# Altium schematic sheet 2.电源.SchDoc
size 297 x 209 mm; SheetNumber: 2; SheetTotal: 13
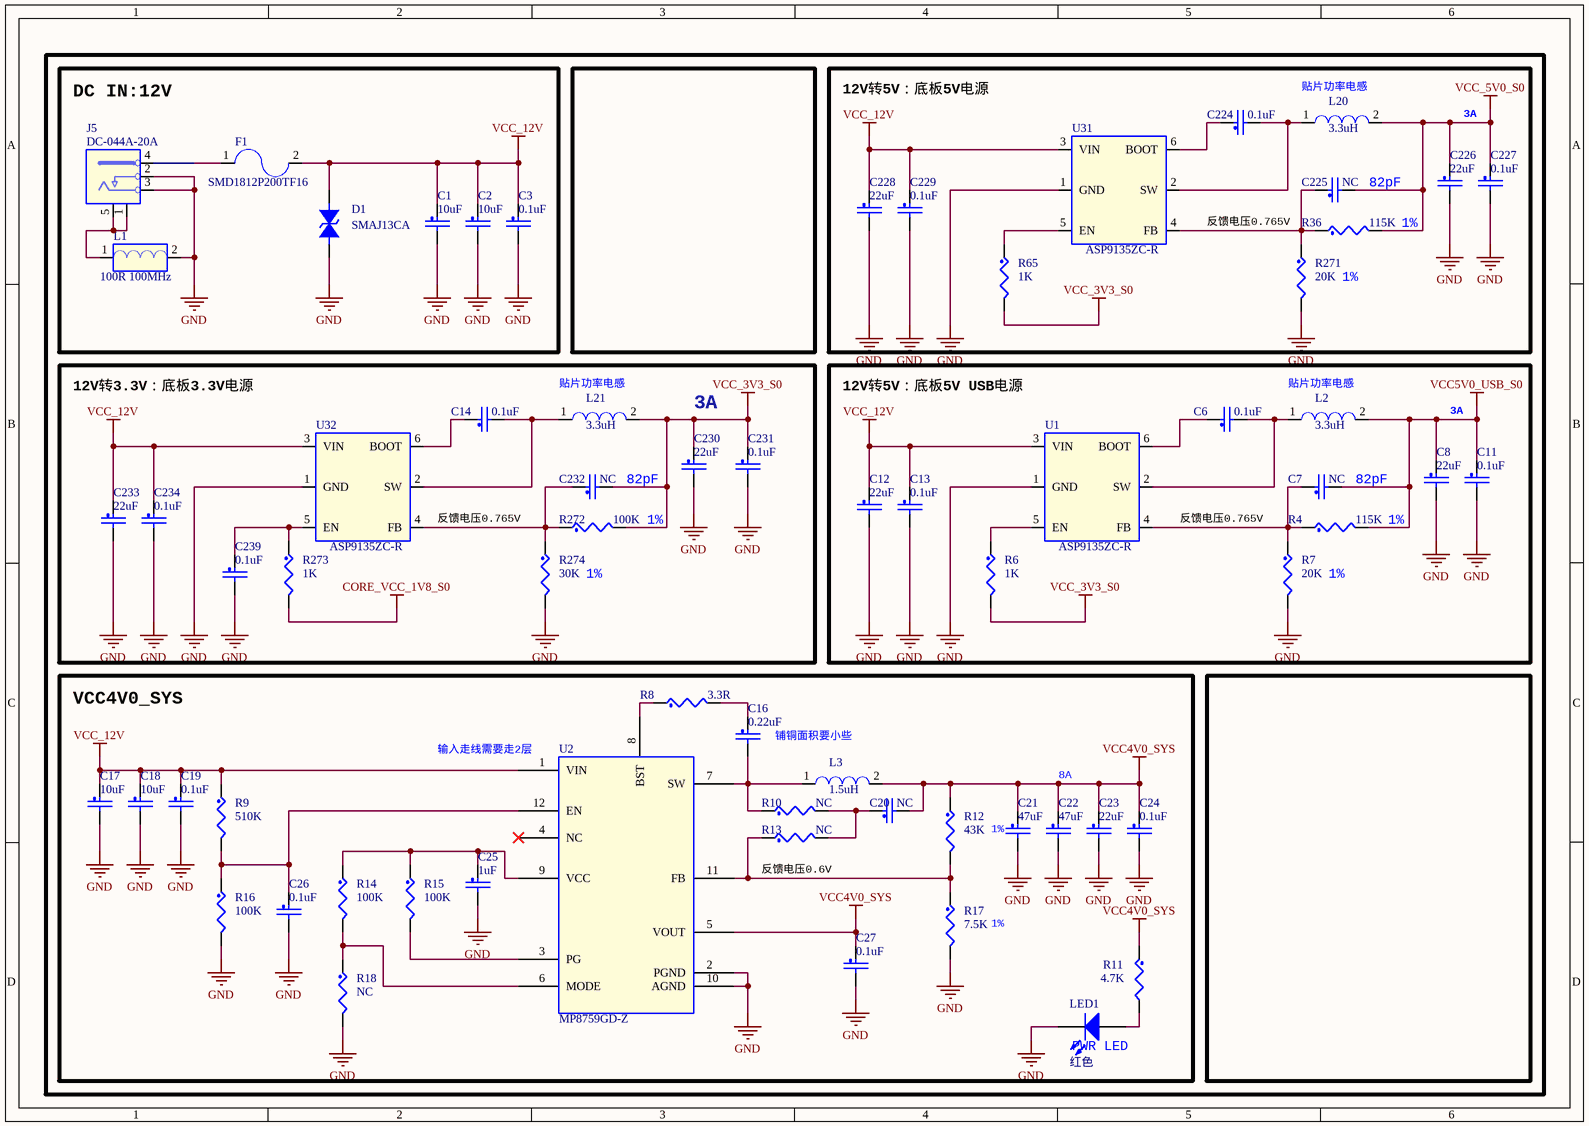
[diagram p0: 2.电源.SchDoc]

## Parts
C1  10uF  [C0603]
C2  10uF  [C0603]
C3  0.1uF  [C0402]
C6  0.1uF  [C0402]
C7  NC  [C0402]
C8  22uF  [C0805]
C11  0.1uF  [C0402]
C12  22uF  [C0805]
C13  0.1uF  [C0402]
C14  0.1uF  [C0402]
C16  0.22uF  [C0402]
C17  10uF  [C0603]
C18  10uF  [C0603]
C19  0.1uF  [C0402]
C20  NC  [C0402]
C21  47uF  [C0805]
C22  47uF  [C0805]
C23  22uF  [C0603]
C24  0.1uF  [C0402]
C25  1uF  [C0402]
C26  0.1uF  [C0402]
C27  0.1uF  [C0402]
C224  0.1uF  [C0402]
C225  NC  [C0402]
C226  22uF  [C0805]
C227  0.1uF  [C0402]
C228  22uF  [C0805]
C229  0.1uF  [C0402]
C230  22uF  [C0805]
C231  0.1uF  [C0402]
C232  NC  [C0402]
C233  22uF  [C0805]
C234  0.1uF  [C0402]
C239  0.1uF  [C0402]
D1  SMAJ13CA  [SMA_CA]
F1  SMD1812P200TF16  [F1812]
J5  DC-044A-20A  [dc_in_th_3p_10r1x11r6]
L1  100R 100MHz  [L0603]
L2  3.3uH  [l4520]
L3  1.5uH  [L0518]
L20  3.3uH  [l4520]
L21  3.3uH  [l4520]
LED1  红色  [LED0603_R]
R4  115K  [R0402]
R6  1K  [R0402]
R7  20K  [R0402]
R8  3.3R  [R0402]
R9  510K  [R0402]
R10  NC  [R0402]
R11  4.7K  [R0402]
R12  43K  [R0402]
R13  NC  [R0402]
R14  100K  [R0402]
R15  100K  [R0402]
R16  100K  [R0402]
R17  7.5K  [R0402]
R18  NC  [R0402]
R36  115K  [R0402]
R65  1K  [R0402]
R271  20K  [R0402]
R272  100K  [R0402]
R273  1K  [R0402]
R274  30K  [R0402]
U1  ASP9135ZC-R  [SOT23_6]
U2  MP8759GD-Z  [QFN12-2R00X3R00]
U31  ASP9135ZC-R  [SOT23_6]
U32  ASP9135ZC-R  [SOT23_6]

## Blocks framed on the sheet
DC IN:12V: C1-C3 D1 F1 J5 L1
12V转5V：底板5V电源: C224-C229 L20 R36 R65 R271 U31
3A: C14 C230-C234 C239 L21 R272-R274 U32
12V转5V：底板5V USB电源: C6-C8 C11-C13 L2 R4 R6 R7 U1
VCC4V0_SYS: C16-C27 L3 LED1 R8-R18 U2

## Nets
CORE_VCC_1V8_S0: R273.2
GND: C1.2 C2.2 C3.2 C8.2 C11.2 C12.2 C13.2 C17.2 C18.2 C19.2 C21.2 C22.2 C23.2 C24.2 C25.2 C26.2 C27.2 C226.2 C227.2 C228.2 C229.2 C230.2 C231.2 C233.2 C234.2 C239.2 D1.1 J5.2 J5.3 L1.2 LED1.2(K) R7.2 R16.2 R17.2 R18.2 R271.2 R274.2 U1.1(GND) U2.2(PGND) U2.10(AGND) U31.1(GND) U32.1(GND)
VCC4V0_SYS: C20.2 C21.1 C22.1 C23.1 C24.1 C27.1 L3.2 R11.1 R12.1 U2.5(VOUT)
VCC5V0_USB_S0: C7.2 C8.1 C11.1 L2.2 R4.2
VCC_3V3_S0: C230.1 C231.1 C232.2 L21.2 R6.2 R65.2 R272.2
VCC_5V0_S0: C225.2 C226.1 C227.1 L20.2 R36.2
VCC_12V: C1.1 C2.1 C3.1 C12.1 C13.1 C17.1 C18.1 C19.1 C228.1 C229.1 C233.1 C234.1 D1.2 F1.2 R9.1 U1.3(VIN) U2.1(VIN) U31.3(VIN) U32.3(VIN)
NetC6_1: C6.1 U1.6(BOOT)
NetC6_2: C6.2 L2.1 U1.2(SW)
NetC7_1: C7.1 R4.1 R7.1 U1.4(FB)
NetC14_1: C14.1 U32.6(BOOT)
NetC14_2: C14.2 L21.1 U32.2(SW)
NetC16_1: C16.1 R8.2
NetC16_2: C16.2 L3.1 R10.1 U2.7(SW)
NetC20_1: C20.1 R10.2 R13.2
NetC25_1: C25.1 R14.1 R15.1 U2.9(VCC)
NetC26_1: C26.1 R9.2 R16.1 U2.12(EN)
NetC224_1: C224.1 U31.6(BOOT)
NetC224_2: C224.2 L20.1 U31.2(SW)
NetC225_1: C225.1 R36.1 R271.1 U31.4(FB)
NetC232_1: C232.1 R272.1 R274.1 U32.4(FB)
NetC239_1: C239.1 R273.1 U32.5(EN)
NetF1_1: F1.1 J5.4
NetJ5_1: J5.1 J5.5 L1.1
NetLED1_1: LED1.1(A) R11.2
NetR6_1: R6.1 U1.5(EN)
NetR8_1: R8.1 U2.8(BST)
NetR12_2: R12.2 R13.1 R17.1 U2.11(FB)
NetR14_2: R14.2 R18.1 U2.6(MODE)
NetR15_2: R15.2 U2.3(PG)
NetR65_1: R65.1 U31.5(EN)

Not connected (* = marked no-connect by the designer): U2 4(NC)*

## Notes on the sheet
- (near L20) 贴片功率电感
- 3A
- 82pF
- 反馈电压0.765V
- 1%
- 12V转3.3V：底板3.3V电源
- (near L21) 贴片功率电感
- (near L2) 贴片功率电感
- (near U32) 反馈电压0.765V
- 铺铜面积要小些
- 输入走线需要走2层
- 8A
- (near R13) 反馈电压0.6V
- (near C21) 1%
- (near R17) 1%
- (near LED1) PWR LED

## Library data of the parts
C1-C3 C6-C8 C11-C14 C16-C27 C224-C234 C239 = CAP_NP
D1 = DIODE BI-DIR TRIG
F1 = FUSE
L1 = BEAD
L2 L3 L20 L21 = IND
LED1 = LED: 贴片LED
R4 R6-R18 R36 R65 R271-R274 = RES
U1 U31 U32 = TP6327GS6